# EAGLE design Atmel project (EAGLE 7.6.0)
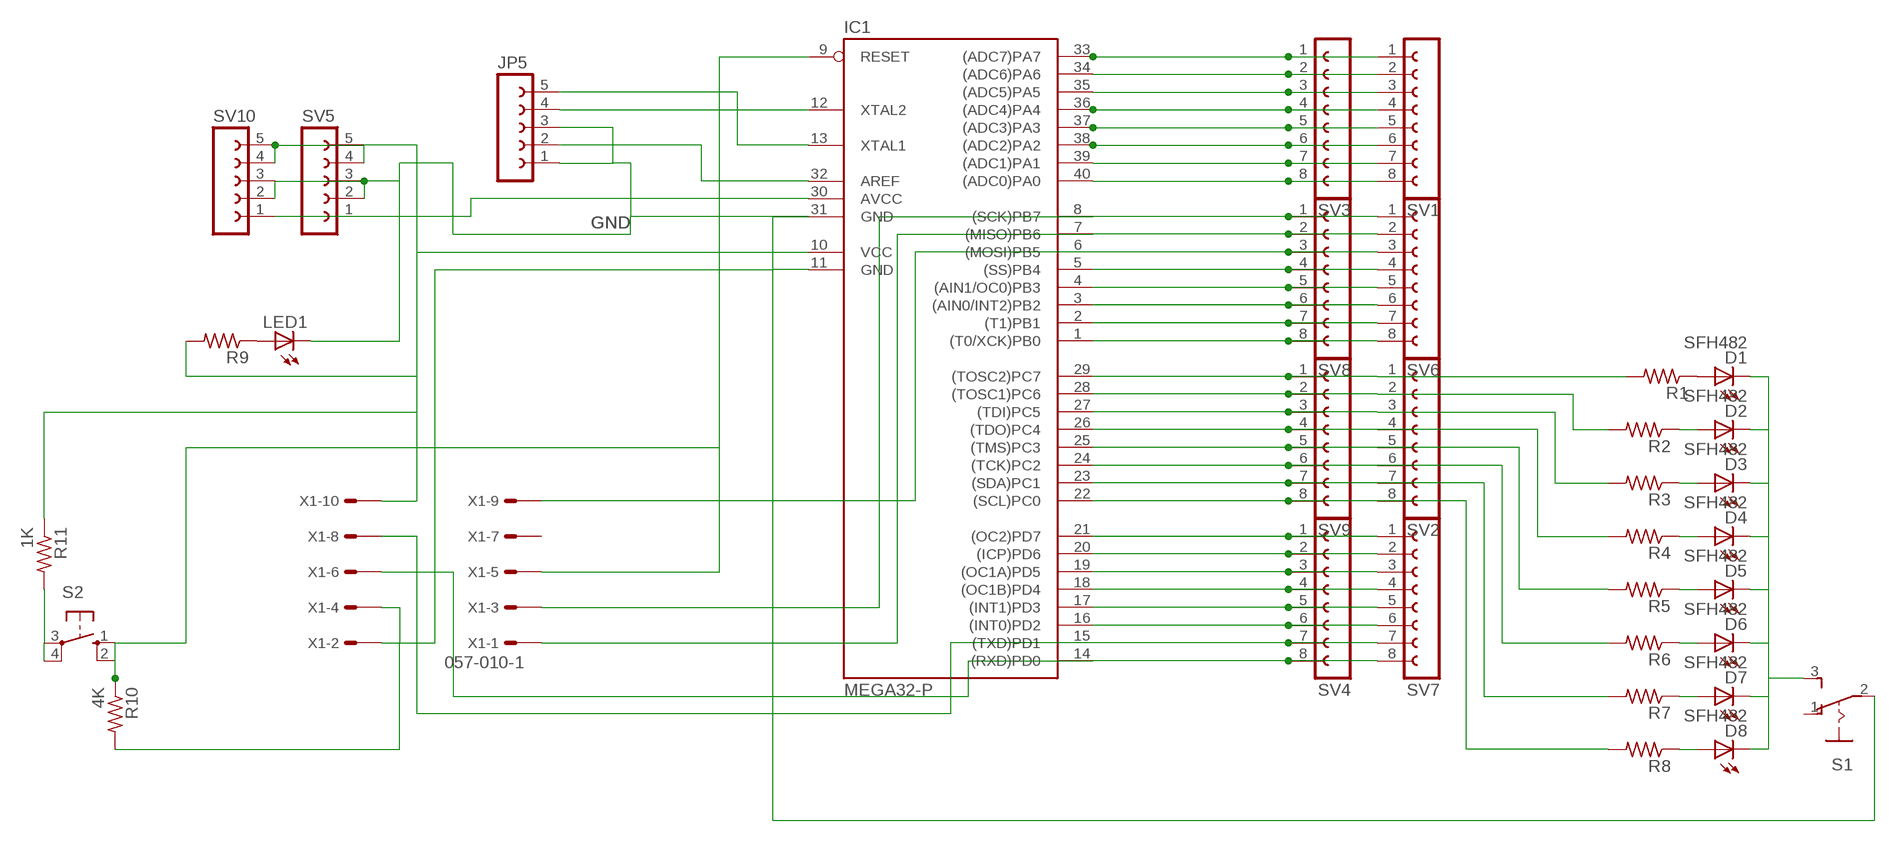
[diagram p0: schematic, sheet 1]

## Parts
D1  SFH482  [SFH482]
D2  SFH482  [SFH482]
D3  SFH482  [SFH482]
D4  SFH482  [SFH482]
D5  SFH482  [SFH482]
D6  SFH482  [SFH482]
D7  SFH482  [SFH482]
D8  SFH482  [SFH482]
IC1  MEGA32-P  [DIL40]
JP5  FE05-1  [FE05-1]
LED1  LED3MM  [LED3MM]
R1  R-US_0204/7  [0204/7]
R2  R-US_0204/7  [0204/7]
R3  R-US_0204/7  [0204/7]
R4  R-US_0204/7  [0204/7]
R5  R-US_0204/7  [0204/7]
R6  R-US_0204/7  [0204/7]
R7  R-US_0204/7  [0204/7]
R8  R-US_0204/7  [0204/7]
R9  R-US_0204/7  [0204/7]
R10  4K  R-US_0204/7  [0204/7]
R11  1K  R-US_0204/7  [0204/7]
S1  255SB  [255SB]
S2  10-XX  [B3F-10XX]
SV1  FE08-1  [FE08]
SV2  FE08-1  [FE08]
SV3  FE08-1  [FE08]
SV4  FE08-1  [FE08]
SV5  FE05-1  [FE05-1]
SV6  FE08-1  [FE08]
SV7  FE08-1  [FE08]
SV8  FE08-1  [FE08]
SV9  FE08-1  [FE08]
SV10  FE05-1  [FE05-1]
X1  057-010-1  [057-010-1]

## Nets
GND: IC1.11(GND) IC1.31(GND) JP5.1 JP5.3 LED1.K(C) R10.2 S1.2(P) SV5.2 SV5.3 SV10.2 SV10.3 X1.2 X1.4
N$1: IC1.40((ADC0)PA0) SV1.8 SV3.8
N$2: IC1.39((ADC1)PA1) SV1.7 SV3.7
N$3: IC1.38((ADC2)PA2) SV1.6 SV3.6
N$4: IC1.37((ADC3)PA3) SV1.5 SV3.5
N$5: IC1.36((ADC4)PA4) SV1.4 SV3.4
N$6: IC1.35((ADC5)PA5) SV1.3 SV3.3
N$7: IC1.34((ADC6)PA6) SV1.2 SV3.2
N$8: IC1.33((ADC7)PA7) SV1.1 SV3.1
N$9: IC1.8((SCK)PB7) SV6.1 SV8.1 X1.3
N$10: IC1.7((MISO)PB6) SV6.2 SV8.2 X1.1
N$11: IC1.12(XTAL2) JP5.4
N$12: IC1.5((SS)PB4) SV6.4 SV8.4
N$13: IC1.4((AIN1/OC0)PB3) SV6.5 SV8.5
N$14: IC1.3((AIN0/INT2)PB2) SV6.6 SV8.6
N$15: IC1.2((T1)PB1) SV6.7 SV8.7
N$16: IC1.1((T0/XCK)PB0) SV6.8 SV8.8
N$17: IC1.29((TOSC2)PC7) R1.2 SV2.1 SV9.1
N$18: IC1.28((TOSC1)PC6) R2.2 SV2.2 SV9.2
N$19: IC1.27((TDI)PC5) R3.2 SV2.3 SV9.3
N$20: D1.K(C) D2.K(C) D3.K(C) D4.K(C) D5.K(C) D6.K(C) D7.K(C) D8.K(C) S1.3(S)
N$21: IC1.30(AVCC) SV5.1 SV10.1
N$22: IC1.32(AREF) JP5.2
N$23: IC1.24((TCK)PC2) R6.2 SV2.6 SV9.6
N$24: IC1.22((SCL)PC0) R8.2 SV2.8 SV9.8
N$25: IC1.21((OC2)PD7) SV4.1 SV7.1
N$26: IC1.20((ICP)PD6) SV4.2 SV7.2
N$27: IC1.19((OC1A)PD5) SV4.3 SV7.3
N$28: IC1.18((OC1B)PD4) SV4.4 SV7.4
N$29: IC1.17((INT1)PD3) SV4.5 SV7.5
N$30: IC1.16((INT0)PD2) SV4.6 SV7.6
N$31: IC1.15((TXD)PD1) SV4.7 SV7.7 X1.8
N$32: IC1.14((RXD)PD0) SV4.8 SV7.8 X1.6
N$33: IC1.25((TMS)PC3) R5.2 SV2.5 SV9.5
N$34: LED1.A R9.1
N$35: D1.A R1.1
N$36: D2.A R2.1
N$37: D3.A R3.1
N$38: D4.A R4.1
N$39: D5.A R5.1
N$40: D6.A R6.1
N$41: D7.A R7.1
N$42: D8.A R8.1
N$43: IC1.9(RESET) R10.1 S2.1(S) S2.2(S1) X1.5
N$44: IC1.23((SDA)PC1) R7.2 SV2.7 SV9.7
N$45: IC1.26((TDO)PC4) R4.2 SV2.4 SV9.4
N$46: IC1.13(XTAL1) JP5.5
N$47: IC1.6((MOSI)PB5) SV6.3 SV8.3 X1.9
N$48: IC1.10(VCC) R9.2 R11.1 SV5.4 SV5.5 SV10.4 SV10.5 X1.10
N$51: R11.2 S2.3(P) S2.4(P1)
Unconnected: S1.1(O) X1.7

## Library data of the parts
D1-D8 = led:SFH482: IR LED infrared emitting diode, Infineon
IC1 = atmel:MEGA32-P: MICROCONTROLLER 32 Kbytes FLASH 2 Kbytes SRAM 1 Kbytes EEPROM USART 8-channel 10 bit ADC Source: www.atmel.com .. doc2503.pdf; MPN: ATMEGA32-16PU; OC_FARNELL: 1661729; OC_NEWARK: 51P1794
JP5 SV5 SV10 = con-lsta:FE05-1: FEMALE HEADER; OC_FARNELL: unknown; OC_NEWARK: unknown
LED1 = led:LED: LED OSRAM: - CHIPLED LG R971, LG N971, LY N971, LG Q971, LY Q971, LO R971, LY R971 LH N974, LH R974 LS Q976, LO Q976, LY Q976 LO Q996 - Hyper CHIPLED LW Q18S LB Q993, LB Q99A, LB R99A - SideLED LS A670, LO A670, LY A670, LG A670, LP A670 LB A673, LV A673, LT A673, LW A673 LH A674 LY A675 LS A676, LA A676, LO A676, LY A676, LW A676 LS A679, LY A679, LG A679 - Hyper Micro SIDELED® LS Y876, LA Y876, LO Y876, LY Y876 LT Y87S - SmartLED LW L88C, LW L88S LB L89C, LB L89S, LG L890 LS L89K, LO L89K, LY L89K LS L896, LA L896, LO L896, LY L896 - TOPLED LS T670, LO T670, LY T670, LG T670, LP T670 LSG T670, LSP T670, LSY T670, LOP T670, LYG T670 LG T671, LOG T671, LSG T671 LB T673, LV T673, LT T673, LW T673 LH T674 LS T676, LA T676, LO T676, LY T676, LB T676, LH T676, LSB T676, LW T676 LB T67C, LV T67C, LT T67C, LS T67K, LO T67K, LY T67K, LW E67C LS E67B, LA E67B, LO E67B, LY E67B, LB E67C, LV E67C, LT E67C LW T67C LS T679, LY T679, LG T679 LS T770, LO T770, LY T770, LG T770, LP T770 LB T773, LV T773, LT T773, LW T773 LH T774 LS E675, LA E675, LY E675, LS T675 LS T776, LA T776, LO T776, LY T776, LB T776 LHGB T686 LT T68C, LB T68C - Hyper Mini TOPLED® LB M676 - Mini TOPLED Santana® LG M470 LS M47K, LO M47K, LY M47K Source: http://www.osram.convergy.de LUXEON: - LUMILED® LXK2-PW12-R00, LXK2-PW12-S00, LXK2-PW14-U00, LXK2-PW14-V00 LXK2-PM12-R00, LXK2-PM12-S00, LXK2-PM14-U00 LXK2-PE12-Q00, LXK2-PE12-R00, LXK2-PE12-S00, LXK2-PE14-T00, LXK2-PE14-U00 LXK2-PB12-K00, LXK2-PB12-L00, LXK2-PB12-M00, LXK2-PB14-N00, LXK2-PB14-P00, LXK2-PB14-Q00 LXK2-PR12-L00, LXK2-PR12-M00, LXK2-PR14-Q00, LXK2-PR14-R00 LXK2-PD12-Q00, LXK2-PD12-R00, LXK2-PD12-S00 LXK2-PH12-R00, LXK2-PH12-S00 LXK2-PL12-P00, LXK2-PL12-Q00, LXK2-PL12-R00 Source: www.luxeon.com KINGBRIGHT: KA-3528ASYC Source: www.kingbright.com
R1-R11 = resistor:R-US_: RESISTOR, American symbol
S1 = switch:255SB: SLIDING SWITCH Distributor Buerklin, 11G810
S2 = switch-omron:10-XX: OMRON SWITCH; MPN: B3F-1000; OC_FARNELL: 176432; OC_NEWARK: 36M3542
SV1-SV4 SV6-SV9 = con-lsta:FE08-1: FEMALE HEADER; OC_FARNELL: unknown; OC_NEWARK: unknown
X1 = con-panduit:057-010-: CONNECTOR 10-pin series 057 contact pc board low profile headers; OC_FARNELL: unknown; OC_NEWARK: unknown

## Net classes
0 default: width 1.016 mm, drill 1.27 mm, clearance 1.016 mm

## Board
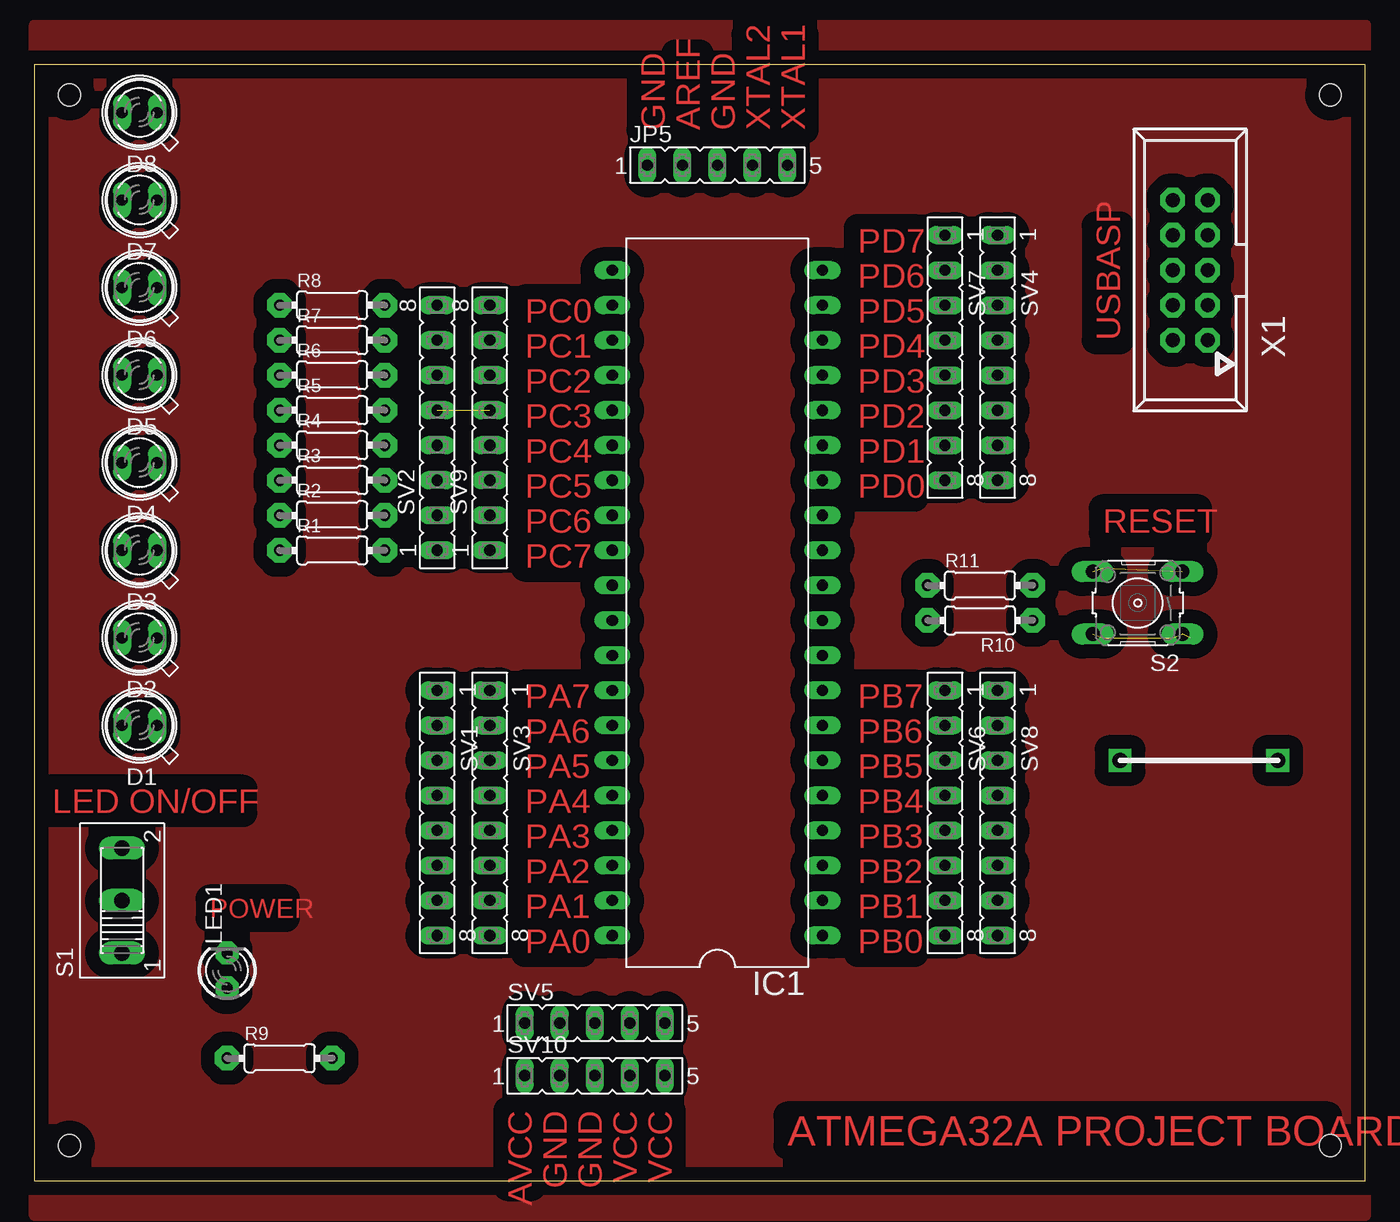
[diagram p1: board, top side]
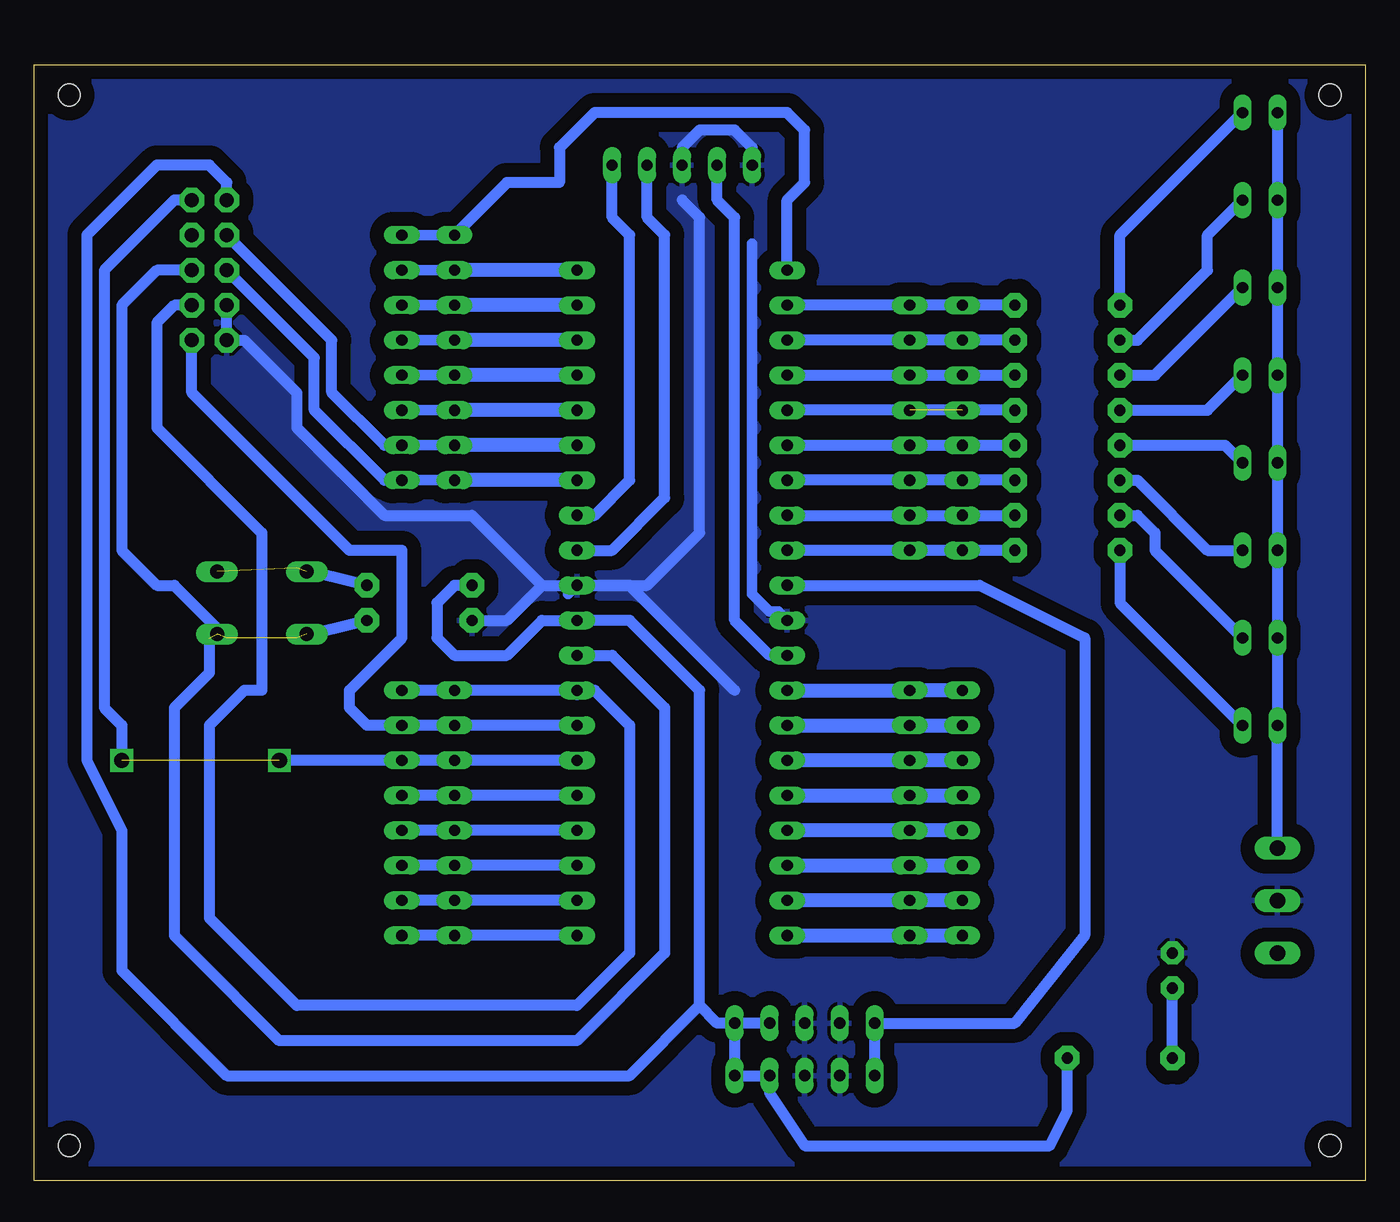
[diagram p2: board, bottom side, seen from below]

Size 96.5 x 80.95 mm. Coordinates in mm from the lower left corner, seen from the top.
Outline: 0,0 96.5,0 96.5,80.95 0,80.95 0,0
Copper layers (1*16): Top 0.035mm / dielectric 1.5mm / Bottom 0.035mm
Design rules "default": minimum track width 10mil, minimum drill 24mil, track to track 8mil, track to pad 8mil, pad to pad 8mil, via to via 8mil, smd to smd 8mil, copper to edge 40mil, drill to drill 8mil, minimum pad ring 10mil, minimum via ring 8mil, stop-mask expansion 4mil, vias tented up to drill 0mil, thermal gap 10mil
Holes 1.6 mm at 2.54,2.54 93.98,2.54 93.98,78.74 2.54,78.74

### Footprints (pad centres in the part's own frame; a part is rotated, then mirrored left to right if it is on the bottom)
SFH482 = drill 0.813 long: A -1.27,0; K 1.27,0
DIL40 = drill 0.813 long: 1 -24.13,-7.62; 2 -21.59,-7.62; 3 -19.05,-7.62; 4 -16.51,-7.62; 5 -13.97,-7.62; 6 -11.43,-7.62; 7 -8.89,-7.62; 8 -6.35,-7.62; 9 -3.81,-7.62; 10 -1.27,-7.62; 11 1.27,-7.62; 12 3.81,-7.62; 13 6.35,-7.62; 14 8.89,-7.62; 15 11.43,-7.62; 16 13.97,-7.62; 17 16.51,-7.62; 18 19.05,-7.62; 19 21.59,-7.62; 20 24.13,-7.62; 21 24.13,7.62; 22 21.59,7.62; 23 19.05,7.62; 24 16.51,7.62; 25 13.97,7.62; 26 11.43,7.62; 27 8.89,7.62; 28 6.35,7.62; 29 3.81,7.62; 30 1.27,7.62; 31 -1.27,7.62; 32 -3.81,7.62; 33 -6.35,7.62; 34 -8.89,7.62; 35 -11.43,7.62; 36 -13.97,7.62; 37 -16.51,7.62; 38 -19.05,7.62; 39 -21.59,7.62; 40 -24.13,7.62
FE05-1 = drill 0.813 long: 1 -5.08,0; 2 -2.54,0; 3 0,0; 4 2.54,0; 5 5.08,0
LED3MM = drill 0.813 pad 1.676 octagon: A -1.27,0; K 1.27,0
0204/7 = drill 0.813 pad 1.778 octagon: 1 -3.81,0; 2 3.81,0
255SB = drill 1.118 long: 1 -3.81,0; 2 0,0; 3 3.81,0
B3F-10XX = drill 1.016 long: 1 -3.251,2.261; 2 3.251,2.261; 3 -3.251,-2.261; 4 3.251,-2.261
FE08 = drill 0.813 long: 1 -8.89,0; 2 -6.35,0; 3 -3.81,0; 4 -1.27,0; 5 1.27,0; 6 3.81,0; 7 6.35,0; 8 8.89,0
057-010-1 = drill 1 pad 1.778 octagon: 1 -5.08,-1.27; 2 -5.08,1.27; 3 -2.54,-1.27; 4 -2.54,1.27; 5 0,-1.27; 6 0,1.27; 7 2.54,-1.27; 8 2.54,1.27; 9 5.08,-1.27; 10 5.08,1.27

### Placement (x,y rotation side)
D1  7.62,33.02 180 top
D2  7.62,39.37 180 top
D3  7.62,45.72 180 top
D4  7.62,52.07 180 top
D5  7.62,58.42 180 top
D6  7.62,64.77 180 top
D7  7.62,71.12 180 top
D8  7.62,77.47 180 top
IC1  49.53,41.91 90 top
JP5  49.53,73.66 0 top
LED1  13.97,15.24 90 top
R1  21.59,45.72 0 top
R2  21.59,48.26 0 top
R3  21.59,50.8 0 top
R4  21.59,53.34 0 top
R5  21.59,55.88 0 top
R6  21.59,58.42 0 top
R7  21.59,60.96 0 top
R8  21.59,63.5 0 top
R9  17.78,8.89 0 top
R10  68.58,40.64 180 top
R11  68.58,43.18 0 top
S1  6.35,20.32 90 top
S2  80.01,41.91 180 top
SV1  29.21,26.67 270 top
SV2  29.21,54.61 90 top
SV3  33.02,26.67 270 top
SV4  69.85,59.69 270 top
SV5  40.64,11.43 0 top
SV6  66.04,26.67 270 top
SV7  66.04,59.69 270 top
SV8  69.85,26.67 270 top
SV9  33.02,54.61 90 top
SV10  40.64,7.62 0 top
X1  83.82,66.04 90 top

### Tracks (layer width: path | path; a pad name or v marks a point on that pad's centre or on a via)
GND
  Bottom 0.762: IC1.31 42.55,41.27 43.18,41.27 44.45,42.55 44.45,67.95 | 57.78,42.55 IC1.11
  Bottom 0.813: 45.72,35.56 53.34,43.18 IC1.11 | IC1.11 52.07,43.18 48.26,46.99 48.26,69.85 49.53,71.12 | X1.4 X1.2 81.28,60.96 77.47,57.15 77.47,54.61 71.12,48.26 64.77,48.26 59.69,43.18 | R10.2 62.23,40.64 59.69,43.18 | 59.69,43.18 IC1.11 | JP5.1 44.45,74.93 45.72,76.2 48.26,76.2 49.53,74.93 JP5.3
  pour Bottom: 0,81.28 96.52,81.28 96.52,0 0,0
N$1
  Bottom 1.016: IC1.40 SV3.8 SV1.8
N$2
  Bottom 1.016: SV1.7 SV3.7 IC1.39
N$3
  Bottom 1.016: IC1.38 SV3.6 SV1.6
N$4
  Bottom 1.016: SV1.5 SV3.5 IC1.37
N$5
  Bottom 1.016: IC1.36 SV3.4 SV1.4
N$6
  Bottom 1.016: SV1.3 SV3.3 IC1.35
N$7
  Bottom 1.016: IC1.34 SV3.2 SV1.2
N$8
  Bottom 1.016: SV1.1 SV3.1 IC1.33
N$9
  Bottom 0.762: 57.15,35.24 IC1.8
  Bottom 0.813: SV8.1 SV6.1 IC1.8 55.88,35.56 53.34,33.02 53.34,16.51 57.15,12.7 77.47,12.7 83.82,19.05 83.82,33.02 81.28,35.56 80.01,35.56 80.01,46.99 87.63,54.61 87.63,62.23 86.36,63.5 X1.3
N$10
  Bottom 0.813: IC1.7 SV6.2 SV8.2 72.39,33.02 73.66,34.29 73.66,35.56 69.85,39.37 69.85,45.72 73.66,45.72 85.09,57.15 X1.1
N$11
  Bottom 0.813: IC1.12 54.61,45.72 50.8,49.53 50.8,68.58 52.07,69.85 JP5.4
N$12
  Bottom 0.813: IC1.5 SV6.4 SV8.4
N$13
  Bottom 0.813: IC1.4 SV6.5 SV8.5
N$14
  Bottom 0.813: IC1.3 SV6.6 SV8.6
N$15
  Bottom 0.813: IC1.2 SV6.7 SV8.7
N$16
  Bottom 0.813: IC1.1 SV6.8 SV8.8
N$17
  Bottom 0.813: R1.2 SV2.1 SV9.1 IC1.29
N$18
  Bottom 0.813: IC1.28 SV9.2 SV2.2 R2.2
N$19
  Bottom 0.813: R3.2 SV2.3 SV9.3 IC1.27
N$20
  Bottom 0.813: D8.K D7.K D6.K D5.K D4.K D3.K D2.K D1.K S1.3
N$21
  Bottom 0.813: IC1.30 27.94,43.18 20.32,39.37 20.32,17.78 25.4,11.43 SV5.1 SV10.1
N$22
  Bottom 0.813: IC1.32 43.18,38.1 45.72,40.64 45.72,69.85 46.99,71.12 JP5.2
N$23
  Bottom 0.813: IC1.24 SV9.6 SV2.6 R6.2
N$24
  Bottom 0.813: R8.2 SV2.8 SV9.8 IC1.22
N$25
  Bottom 0.762: SV7.1 SV4.1
  Bottom 0.813: IC1.21 41.91,71.12 40.64,72.39 40.64,76.2 41.91,77.47 55.88,77.47 58.42,74.93 58.42,72.39 62.23,72.39 SV7.1
N$26
  Bottom 0.762: SV7.2 SV4.2
  Bottom 1.016: IC1.20 SV7.2
N$27
  Bottom 0.762: SV7.3 SV4.3
  Bottom 1.016: IC1.19 SV7.3
N$28
  Bottom 0.762: SV7.4 SV4.4
  Bottom 1.016: IC1.18 SV7.4
N$29
  Bottom 0.762: SV7.5 SV4.5
  Bottom 1.016: IC1.17 SV7.5
N$30
  Bottom 0.762: SV7.6 SV4.6
  Bottom 1.016: IC1.16 SV7.6
N$31
  Bottom 0.762: SV7.7 SV4.7
  Bottom 0.813: SV4.7 71.12,53.34 74.93,57.15 74.93,60.96 X1.8
  Bottom 1.016: IC1.15 SV7.7
N$32
  Bottom 0.762: SV7.8 SV4.8
  Bottom 0.813: SV4.8 71.12,50.8 76.2,55.88 76.2,59.69 X1.6
  Bottom 1.016: IC1.14 SV7.8
N$33  (1 unrouted)
  Bottom 0.813: R5.2 SV2.5 IC1.25
N$34
  Bottom 0.813: R9.1 LED1.A
N$35
  Bottom 0.813: R1.1 17.78,41.91 D1.A
N$36
  Bottom 0.813: R2.1 16.51,48.26 15.24,46.99 15.24,45.72 D2.A
N$37
  Bottom 0.813: R3.1 16.51,50.8 11.43,45.72 D3.A
N$38
  Bottom 0.813: R4.1 10.16,53.34 D4.A
N$39
  Bottom 0.813: R5.1 11.43,55.88 D5.A
N$40
  Bottom 0.813: R6.1 15.24,58.42 D6.A
N$41
  Bottom 0.813: R7.1 16.51,60.96 11.43,66.04 11.43,68.58 D7.A
N$42
  Bottom 0.813: R8.1 17.78,68.58 D8.A
N$43  (4 unrouted)
  Bottom 0.813: 83.82,39.37 83.82,36.83 86.36,34.29 86.36,17.78 85.09,16.51 78.74,10.16 57.15,10.16 50.8,16.51 50.8,34.29 54.61,38.1 IC1.9 | R10.1 77.47,39.37 | X1.5 87.63,66.04 90.17,63.5 90.17,45.72 87.63,43.18 86.36,43.18 82.55,39.37
N$44
  Bottom 0.813: R7.2 SV2.7 SV9.7 IC1.23
N$45
  Bottom 0.813: IC1.26 SV9.4 SV2.4 R4.2
N$46
  Bottom 0.813: IC1.13 55.88,48.26 53.34,50.8 53.34,68.58 54.61,69.85 JP5.5
N$47  (via drill 1.1 pad 1.27)  (1 unrouted)
  Bottom 0.813: IC1.6 SV6.3 SV8.3 v78.74,30.48 | X1.9 86.36,71.12 91.44,66.04 91.44,34.29 90.17,33.02 v90.17,30.48
N$48
  Bottom 0.813: 48.26,12.7 48.26,35.56 53.34,40.64 IC1.10 59.69,40.64 62.23,38.1 66.04,38.1 67.31,39.37 67.31,41.91 66.04,43.18 R11.1 | X1.10 82.55,72.39 83.82,73.66 87.63,73.66 92.71,68.58 92.71,30.48 90.17,25.4 90.17,15.24 82.55,7.62 53.34,7.62 48.26,12.7 | SV5.4 SV5.5 | SV5.5 SV10.5 SV10.4 43.18,6.35 40.64,2.54 22.86,2.54 21.59,5.08 R9.2 | SV5.5 46.99,11.43 48.26,12.7
N$49
  pour Top: 0,83.82 96.52,83.82 96.52,-2.54 0,-2.54
N$51  (2 unrouted)
  Bottom 0.813: R11.2 77.47,44.45

### Text on the board
Top: GND | AREF | GND | XTAL2 | XTAL1 | PD7 | PD6 | PC0 | PD5 | USBASP | PC1 | PD4 | PC2 | PD3 | PC3 | PD2 | PC4 | PD1 | PC5 | PD0 | PC6 | RESET | PC7 | PA7 | PB7 | PA6 | PB6 | PA5 | PB5 | LED ON/OFF | PA4 | PB4 | PA3 | PB3 | PA2 | PB2 | POWER | PA1 | PB1 | PA0 | PB0 | AVCC | GND | GND | VCC | VCC | ATMEGA32A PROJECT BOARD